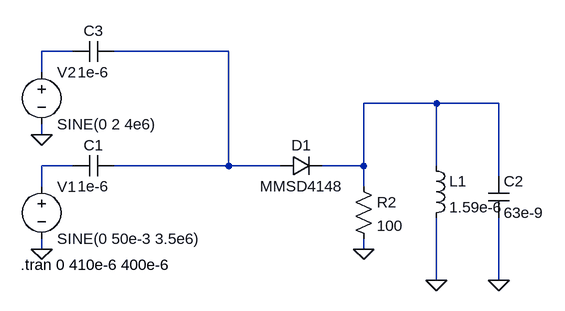
[diagram p0: schematic diodo.asc]
diodo.asc, the LTspice schematic file:
Version 4
SHEET 1 880 680
WIRE -112 -32 -160 -32
WIRE 128 -32 -48 -32
WIRE -160 0 -160 -32
WIRE 448 48 336 48
WIRE 544 48 448 48
WIRE -160 96 -160 80
WIRE -112 144 -160 144
WIRE 128 144 128 -32
WIRE 128 144 -48 144
WIRE 208 144 128 144
WIRE 336 144 336 48
WIRE 336 144 272 144
WIRE 448 144 448 48
WIRE 544 160 544 48
WIRE -160 176 -160 144
WIRE 336 176 336 144
WIRE -160 272 -160 256
WIRE 336 272 336 256
WIRE 448 320 448 224
WIRE 544 320 544 224
FLAG -160 96 0
FLAG -160 272 0
FLAG 336 272 0
FLAG 448 320 0
FLAG 544 320 0
SYMBOL diode 208 160 R270
WINDOW 0 32 32 VTop 2
WINDOW 3 0 32 VBottom 2
SYMATTR InstName D1
SYMATTR Value MMSD4148
SYMBOL res 320 160 R0
SYMATTR InstName R2
SYMATTR Value 100
SYMBOL cap -48 128 R90
WINDOW 0 0 32 VBottom 2
WINDOW 3 32 32 VTop 2
SYMATTR InstName C1
SYMATTR Value 1e-6
SYMBOL voltage -160 160 R0
WINDOW 123 0 0 Left 0
WINDOW 39 0 0 Left 0
SYMATTR InstName V1
SYMATTR Value SINE(0 50e-3 3.5e6)
SYMBOL voltage -160 -16 R0
WINDOW 123 0 0 Left 0
WINDOW 39 0 0 Left 0
SYMATTR InstName V2
SYMATTR Value SINE(0 2 4e6)
SYMBOL ind 432 128 R0
SYMATTR InstName L1
SYMATTR Value 1.59e-6
SYMBOL cap 528 160 R0
SYMATTR InstName C2
SYMATTR Value 63e-9
SYMBOL cap -48 -48 R90
WINDOW 0 0 32 VBottom 2
WINDOW 3 32 32 VTop 2
SYMATTR InstName C3
SYMATTR Value 1e-6
TEXT -192 296 Left 2 !.tran 0 410e-6 400e-6

The netlist it stands for:
* diodo.asc
D1 N002 N003 MMSD4148
R2 N003 0 100
C1 N002 N004 1e-6
V1 N004 0 SINE(0 50e-3 3.5e6)
V2 N001 0 SINE(0 2 4e6)
L1 N003 0 1.59e-6
C2 N003 0 63e-9
C3 N002 N001 1e-6
.model D D
.lib standard.dio
.tran 0 410e-6 400e-6
.backanno
.end